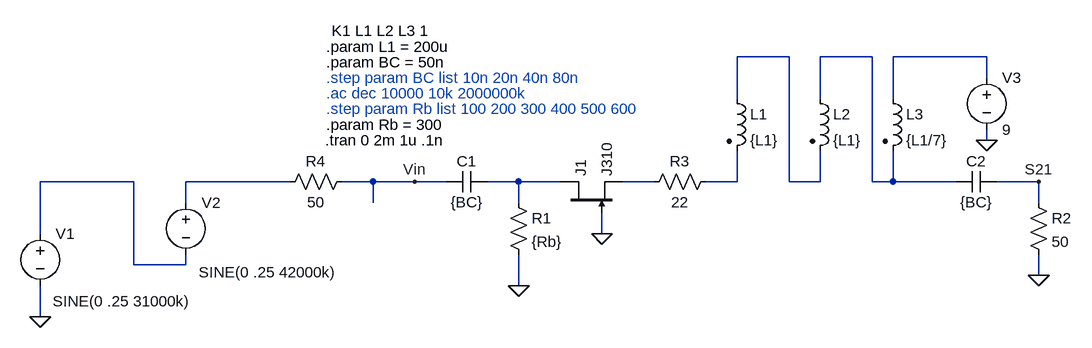
[diagram p0: schematic ece522p3.3.asc]
ece522p3.3.asc, the LTspice schematic file:
Version 4
SHEET 1 1640 696
WIRE 544 -16 464 -16
WIRE 672 -16 592 -16
WIRE 848 -16 704 -16
WIRE 848 16 848 -16
WIRE 464 48 464 -16
WIRE 592 48 592 -16
WIRE 704 48 704 -16
WIRE 848 112 848 96
WIRE -464 176 -608 176
WIRE -224 176 -384 176
WIRE -96 176 -144 176
WIRE -32 176 -96 176
WIRE 16 176 -32 176
WIRE 128 176 80 176
WIRE 192 176 128 176
WIRE 336 176 288 176
WIRE 464 176 464 128
WIRE 464 176 416 176
WIRE 544 176 544 -16
WIRE 592 176 592 128
WIRE 592 176 544 176
WIRE 672 176 672 -16
WIRE 704 176 704 128
WIRE 704 176 672 176
WIRE 800 176 704 176
WIRE 928 176 864 176
WIRE -384 208 -384 176
WIRE -96 208 -96 176
WIRE 128 208 128 176
WIRE 928 208 928 176
WIRE -608 256 -608 176
WIRE 256 256 256 224
WIRE -464 304 -464 176
WIRE -384 304 -384 288
WIRE -384 304 -464 304
WIRE 928 320 928 288
WIRE 128 336 128 288
WIRE -608 384 -608 336
FLAG -608 384 0
FLAG 128 336 0
FLAG 256 256 0
FLAG -32 176 Vin
FLAG 848 112 0
FLAG 928 320 0
FLAG 928 176 S21
SYMBOL cap 80 160 R90
WINDOW 0 0 32 VBottom 2
WINDOW 3 32 32 VTop 2
SYMATTR InstName C1
SYMATTR Value {BC}
SYMBOL res 112 192 R0
SYMATTR InstName R1
SYMATTR Value {Rb}
SYMBOL res 432 160 R90
WINDOW 0 0 56 VBottom 2
WINDOW 3 32 56 VTop 2
SYMATTR InstName R3
SYMATTR Value 22
SYMBOL njf 192 224 R270
SYMATTR InstName J1
SYMATTR Value J310
SYMBOL voltage -608 240 R0
WINDOW 3 19 120 Left 2
WINDOW 123 19 92 Left 2
WINDOW 39 0 0 Left 0
SYMATTR InstName V1
SYMATTR Value SINE(0 .25 31000k)
SYMBOL voltage -384 192 R0
WINDOW 3 20 123 Left 2
WINDOW 123 20 95 Left 2
WINDOW 39 0 0 Left 0
SYMATTR InstName V2
SYMATTR Value SINE(0 .25 42000k)
SYMBOL res -128 160 R90
WINDOW 0 0 56 VBottom 2
WINDOW 3 32 56 VTop 2
SYMATTR InstName R4
SYMATTR Value 50
SYMBOL voltage 848 0 R0
WINDOW 123 0 0 Left 0
WINDOW 39 0 0 Left 0
SYMATTR InstName V3
SYMATTR Value 9
SYMBOL res 912 192 R0
SYMATTR InstName R2
SYMATTR Value 50
SYMBOL ind2 448 32 R0
SYMATTR InstName L1
SYMATTR Value {L1}
SYMATTR Type ind
SYMBOL ind2 576 32 R0
SYMATTR InstName L2
SYMATTR Value {L1}
SYMATTR Type ind
SYMBOL ind2 688 32 R0
SYMATTR InstName L3
SYMATTR Value {L1/7}
SYMATTR Type ind
SYMBOL cap 864 160 R90
WINDOW 0 0 32 VBottom 2
WINDOW 3 32 32 VTop 2
SYMATTR InstName C2
SYMATTR Value {BC}
TEXT -168 40 Left 2 ;.ac dec 10000 10k 2000000k
TEXT -168 64 Left 2 ;.step param Rb list 100 200 300 400 500 600
TEXT -168 88 Left 2 !.param Rb = 300
TEXT -170 112 Left 2 !.tran 0 2m 1u .1n
TEXT -168 -32 Left 2 !.param L1 = 200u
TEXT -160 -56 Left 2 !K1 L1 L2 L3 1
TEXT -168 16 Left 2 ;.step param BC list 10n 20n 40n 80n
TEXT -168 -8 Left 2 !.param BC = 50n

The netlist it stands for:
* ece522p3.3.asc
C1 N006 Vin {BC}
R1 N006 0 {Rb}
R3 N008 N007 22
J1 N006 0 N007 J310
V1 N004 0 SINE(0 .25 31000k)
V2 N005 N004 SINE(0 .25 42000k)
R4 Vin N005 50
V3 N003 0 9
R2 S21 0 50
L1 N001 N008 {L1}
L2 N002 N001 {L1}
L3 N003 N002 {L1/7}
C2 S21 N002 {BC}
.model NJF NJF
.model PJF PJF
.lib standard.jft
* .ac dec 10000 10k 2000000k
* .step param Rb list 100 200 300 400 500 600
.param Rb = 300
.tran 0 2m 1u .1n
.param L1 = 200u
K1 L1 L2 L3 1
* .step param BC list 10n 20n 40n 80n
.param BC = 50n
.backanno
.end